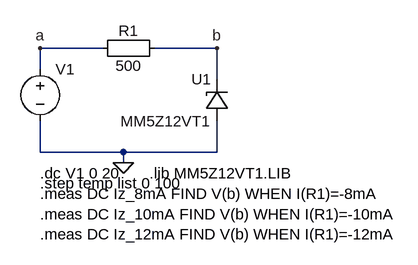
[diagram p0: schematic zener_va_12v.asc]
zener_va_12v.asc, the LTspice schematic file:
Version 4
SHEET 1 880 680
WIRE 112 -256 16 -256
WIRE 288 -256 192 -256
WIRE 16 -224 16 -256
WIRE 288 -208 288 -256
WIRE 16 -96 16 -144
WIRE 144 -96 16 -96
WIRE 288 -96 288 -144
WIRE 288 -96 144 -96
WIRE 144 -80 144 -96
FLAG 144 -80 0
FLAG 288 -256 b
FLAG 16 -256 a
SYMBOL Misc\\EuropeanResistor 208 -272 R90
WINDOW 0 5 56 VBottom 2
WINDOW 3 27 56 VTop 2
SYMATTR InstName R1
SYMATTR Value 500
SYMBOL zener-macro-model 304 -144 R180
WINDOW 0 24 64 Left 2
WINDOW 3 24 0 Left 2
SYMATTR InstName U1
SYMATTR Value MM5Z12VT1
SYMBOL voltage 16 -240 R0
SYMATTR InstName V1
SYMATTR Value ""
TEXT 16 -64 Left 2 !.dc V1 0 20
TEXT 16 -48 Left 2 !.step temp list 0 100
TEXT 184 -64 Left 2 !.lib MM5Z12VT1.LIB
TEXT 16 -32 Left 2 !.meas DC Iz_8mA FIND V(b) WHEN I(R1)=-8mA\n.meas DC Iz_10mA FIND V(b) WHEN I(R1)=-10mA\n.meas DC Iz_12mA FIND V(b) WHEN I(R1)=-12mA

The netlist it stands for:
* zener_va_12v.asc
R1 b a 500
XU1 0 b MM5Z12VT1  ; pins + -
V1 a 0
.dc V1 0 20
.step temp list 0 100
.lib MM5Z12VT1.LIB
.meas DC Iz_8mA FIND V(b) WHEN I(R1)=-8mA
.meas DC Iz_10mA FIND V(b) WHEN I(R1)=-10mA
.meas DC Iz_12mA FIND V(b) WHEN I(R1)=-12mA
.backanno
.end